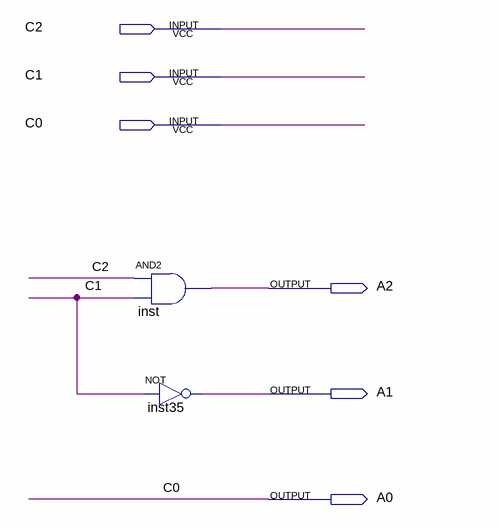
[diagram p0: schematic sheet]
// Quartus schematic circuitA.bdf as structural Verilog: 2 symbols, 6 pins
module circuitA (
  input  C2,
  input  C1,
  input  C0,
  output A2,
  output A1,
  output A0
);

  and inst (A2, C2, C1);
  not inst35 (A1, C1);

  assign A0 = C0;
endmodule
